# Altium schematic sheet CLK_src&sys_logic.SchDoc
size A2
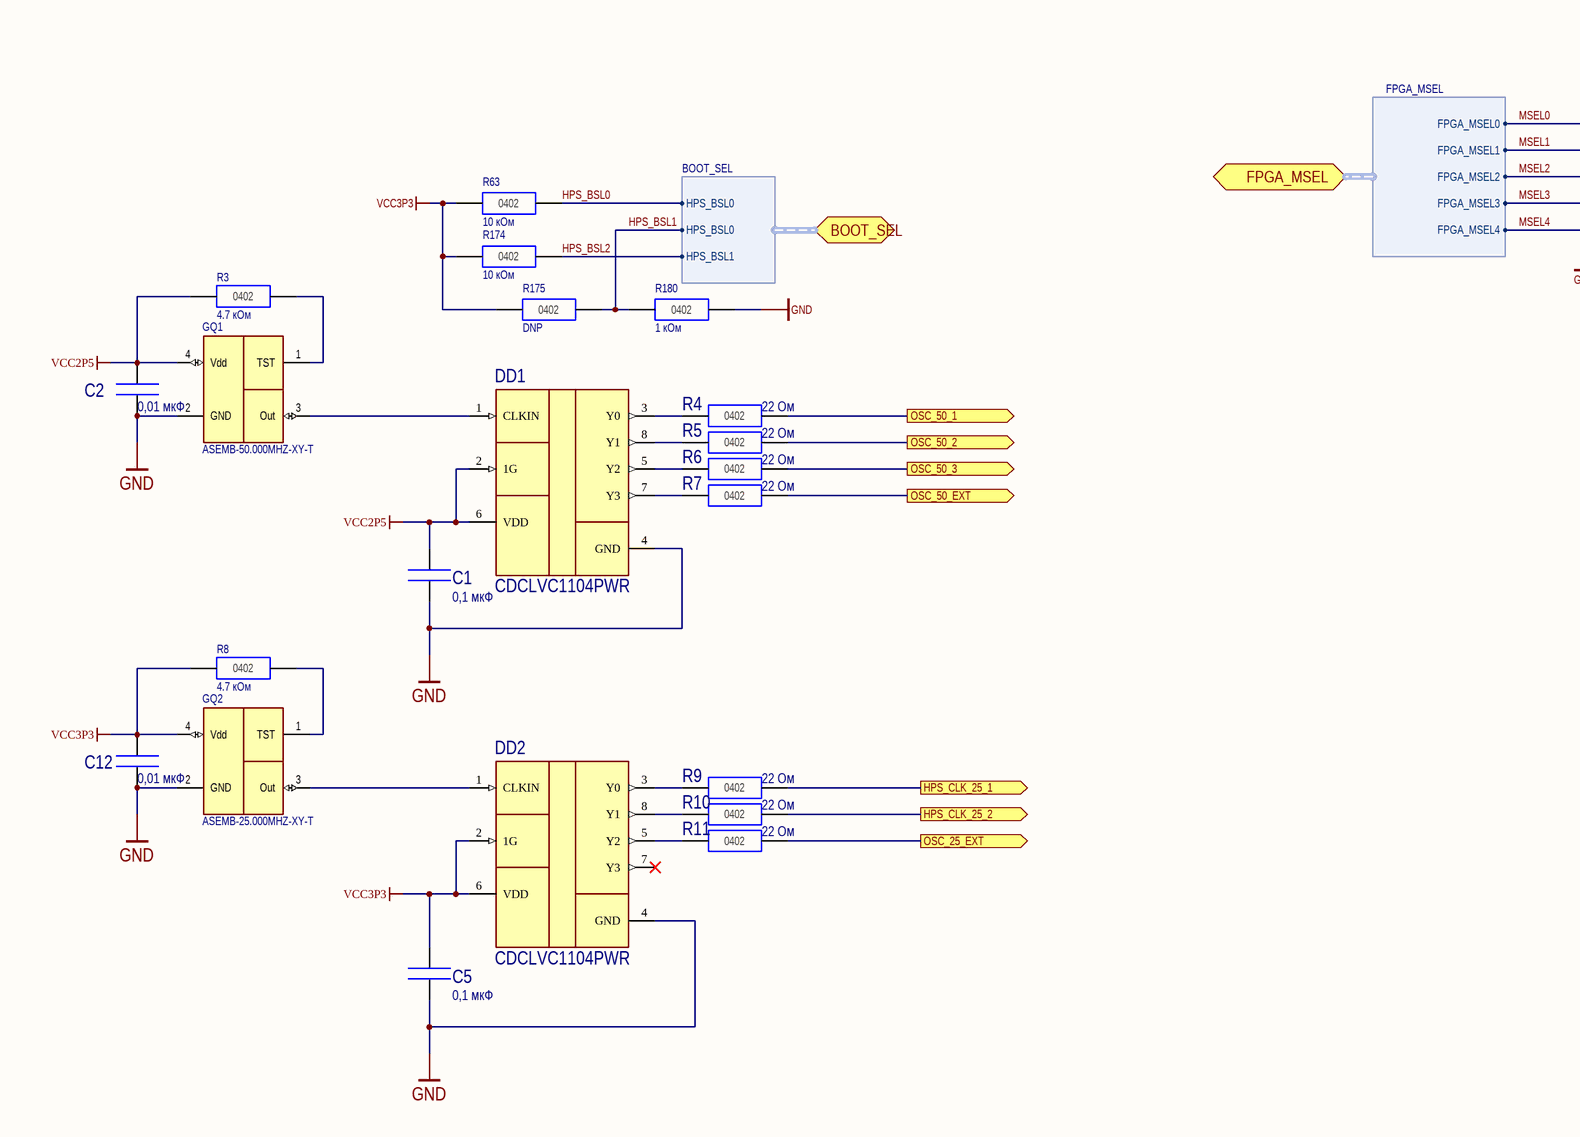
[diagram p0: CLK_src&sys_logic.SchDoc, left]
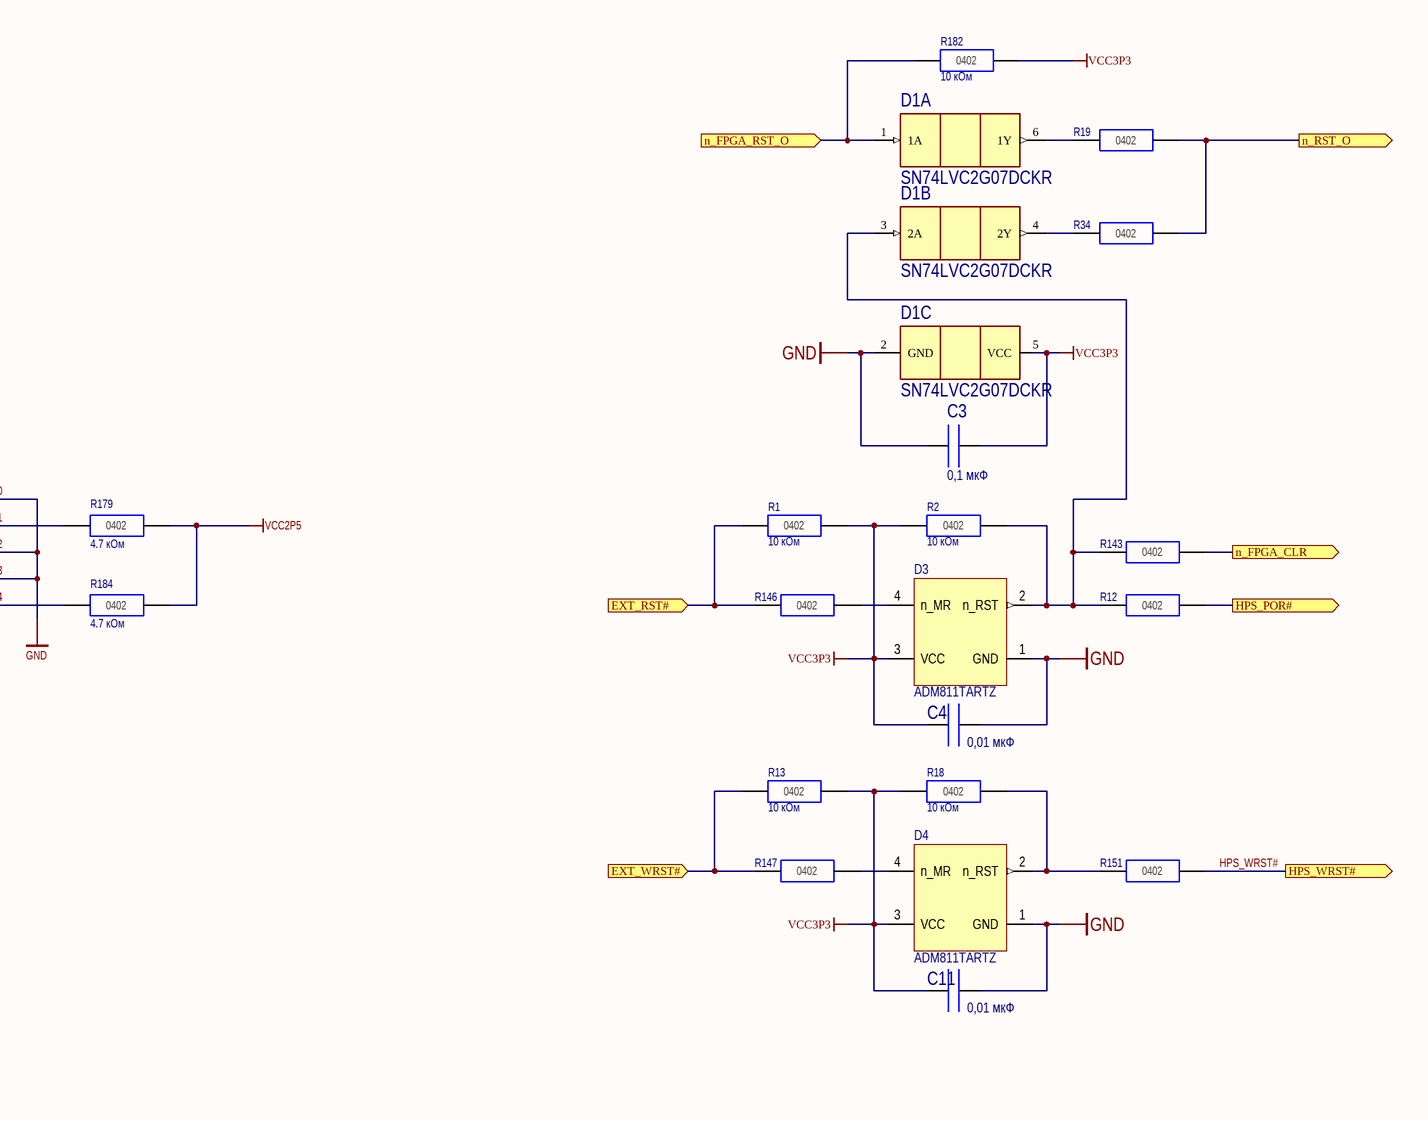
[diagram p1: CLK_src&sys_logic.SchDoc, right]

## Parts
C1  value 0,1 мкФ  [CC0402(1005)]  (hidden comment: CC0402-X7R-0,1 мкФ-20%-10В)
C2  value 0,01 мкФ  [CC0402(1005)]  (hidden comment: CC0402-X7R-0,01 мкФ-10%-50В)
C3  value 0,1 мкФ  [CC0402(1005)]  (hidden comment: CC0402-X7R-0,1 мкФ-20%-10В)
C4  value 0,01 мкФ  [CC0402(1005)]  (hidden comment: CC0402-X7R-0,01 мкФ-10%-50В)
C5  value 0,1 мкФ  [CC0402(1005)]  (hidden comment: CC0402-X7R-0,1 мкФ-20%-10В)
C11  value 0,01 мкФ  [CC0402(1005)]  (hidden comment: CC0402-X7R-0,01 мкФ-10%-50В)
C12  value 0,01 мкФ  [CC0402(1005)]  (hidden comment: CC0402-X7R-0,01 мкФ-10%-50В)
D1  SN74LVC2G07DCKR  [DCKR]  (parts A,B,C of 3)
D3  ADM811TARTZ  [SOT-143]
D4  ADM811TARTZ  [SOT-143]
DD1  CDCLVC1104PWR  [TSSOP-8]
DD2  CDCLVC1104PWR  [TSSOP-8]
GQ1  ASEMB-50.000MHZ-XY-T  [DFN210P320X100-4N]
GQ2  ASEMB-25.000MHZ-XY-T  [DFN210P320X100-4N]
R1  value 10 кОм  [CR0402(1005)]  (hidden comment: CR0402-10 кОм-±5%)
R2  value 10 кОм  [CR0402(1005)]  (hidden comment: CR0402-10 кОм-±5%)
R3  value 4.7 кОм  [CR0402(1005)]  (hidden comment: CR0402-4.7 кОм-±5%)
R4  value 22 Ом  [CR0402(1005)]  (hidden comment: CR0402-22 Ом-±5%)
R5  value 22 Ом  [CR0402(1005)]  (hidden comment: CR0402-22 Ом-±5%)
R6  value 22 Ом  [CR0402(1005)]  (hidden comment: CR0402-22 Ом-±5%)
R7  value 22 Ом  [CR0402(1005)]  (hidden comment: CR0402-22 Ом-±5%)
R8  value 4.7 кОм  [CR0402(1005)]  (hidden comment: CR0402-4.7 кОм-±5%)
R9  value 22 Ом  [CR0402(1005)]  (hidden comment: CR0402-22 Ом-±5%)
R10  value 22 Ом  [CR0402(1005)]  (hidden comment: CR0402-22 Ом-±5%)
R11  value 22 Ом  [CR0402(1005)]  (hidden comment: CR0402-22 Ом-±5%)
R12  CR0402-0 Ом-±5%  [CR0402(1005)]  (value not drawn)
R13  value 10 кОм  [CR0402(1005)]  (hidden comment: CR0402-10 кОм-±5%)
R18  value 10 кОм  [CR0402(1005)]  (hidden comment: CR0402-10 кОм-±5%)
R19  CR0402-0 Ом-±5%  [CR0402(1005)]  (value not drawn)
R34  CR0402-0 Ом-±5%  [CR0402(1005)]  (value not drawn)
R63  value 10 кОм  [CR0402(1005)]  (hidden comment: CR0402-10 кОм-±5%)
R143  CR0402-0 Ом-±5%  [CR0402(1005)]  (value not drawn)
R146  CR0402-0 Ом-±5%  [CR0402(1005)]  (value not drawn)
R147  CR0402-0 Ом-±5%  [CR0402(1005)]  (value not drawn)
R151  CR0402-0 Ом-±5%  [CR0402(1005)]  (value not drawn)
R174  value 10 кОм  [CR0402(1005)]  (hidden comment: CR0402-10 кОм-±5%)
R175  value DNP  [CR0402(1005)]  (hidden comment: CR0402-DNP-±5%)
R179  value 4.7 кОм  [CR0402(1005)]  (hidden comment: CR0402-4.7 кОм-±5%)
R180  value 1 кОм  [CR0402(1005)]  (hidden comment: CR0402-1 кОм-±5%)
R182  value 10 кОм  [CR0402(1005)]  (hidden comment: CR0402-10 кОм-±5%)
R184  value 4.7 кОм  [CR0402(1005)]  (hidden comment: CR0402-4.7 кОм-±5%)

## Ports
BOOT_SEL (harness BOOT_SEL), EXT_RST# (in), EXT_WRST# (in), FPGA_MSEL (harness FPGA_MSEL), HPS_CLK_25_1 (out), HPS_CLK_25_2 (out), HPS_POR# (out), HPS_WRST# (out), n_FPGA_CLR (out), n_FPGA_RST_O (in), n_RST_O (out), OSC_25_EXT (out), OSC_50_1 (out), OSC_50_2 (out), OSC_50_3 (out), OSC_50_EXT (out)

## Harnesses
FPGA_MSEL: FPGA_MSEL0, FPGA_MSEL1, FPGA_MSEL2, FPGA_MSEL3, FPGA_MSEL4
BOOT_SEL: HPS_BSL0, HPS_BSL0, HPS_BSL1

## Nets
MSEL0: C1.2(-) C2.1(+) C3.1(+) C4.1(+) C5.2(-) C11.1(+) C12.1(+) D1.2(GND) D3.1(GND) D4.1(GND) DD1.4(GND) DD2.4(GND) GQ1.2(GND) GQ2.2(GND) R180.2(-) ; port FPGA_MSEL.FPGA_MSEL0, port FPGA_MSEL.FPGA_MSEL2, port FPGA_MSEL.FPGA_MSEL3  [also labelled GND, MSEL2, MSEL3]
VCC2P5: C1.1(+) C2.2(-) DD1.2(1G) DD1.6(VDD) GQ1.4(Vdd) R3.1(+) R179.2(-) R184.2(-)
VCC3P3: C3.2(-) C4.2(-) C5.1(+) C11.2(-) C12.2(-) D1.5(VCC) D3.3(VCC) D4.3(VCC) DD2.2(1G) DD2.6(VDD) GQ2.4(Vdd) R1.2(-) R2.1(+) R8.1(+) R13.2(-) R18.1(+) R63.1(+) R174.1(+) R175.1(+) R182.2(-)
EXT_RST#: R1.1(+) R146.1(+) ; port EXT_RST#
EXT_WRST#: R13.1(+) R147.1(+) ; port EXT_WRST#
HPS_BSL0: R63.2(-) R175.2(-) R180.1(+) ; port BOOT_SEL.HPS_BSL0  [also labelled HPS_BSL1]
HPS_BSL2: R174.2(-) ; port BOOT_SEL.HPS_BSL1
HPS_CLK_25_1: R9.2(-) ; port HPS_CLK_25_1
HPS_CLK_25_2: R10.2(-) ; port HPS_CLK_25_2
HPS_POR#: R12.2(-) ; port HPS_POR#
HPS_WRST#: R151.2(-) ; port HPS_WRST#
MSEL1: R179.1(+) ; port FPGA_MSEL.FPGA_MSEL1
MSEL4: R184.1(+) ; port FPGA_MSEL.FPGA_MSEL4
n_FPGA_CLR: R143.2(-) ; port n_FPGA_CLR
n_FPGA_RST_O: D1.1(1A) R182.1(+) ; port n_FPGA_RST_O
n_RST_O: R19.2(-) R34.2(-) ; port n_RST_O
OSC_25_EXT: R11.2(-) ; port OSC_25_EXT
OSC_50_1: R4.2(-) ; port OSC_50_1
OSC_50_2: R5.2(-) ; port OSC_50_2
OSC_50_3: R6.2(-) ; port OSC_50_3
OSC_50_EXT: R7.2(-) ; port OSC_50_EXT
NetD1_3: D1.3(2A) D3.2(n_RST) R2.2(-) R12.1(+) R143.1(+)
NetD1_4: D1.4(2Y) R34.1(+)
NetD1_6: D1.6(1Y) R19.1(+)
NetD3_4: D3.4(n_MR) R146.2(-)
NetD4_2: D4.2(n_RST) R18.2(-) R151.1(+)
NetD4_4: D4.4(n_MR) R147.2(-)
NetDD1_1: DD1.1(CLKIN) GQ1.3(Out)
NetDD1_3: DD1.3(Y0) R4.1(+)
NetDD1_5: DD1.5(Y2) R6.1(+)
NetDD1_7: DD1.7(Y3) R7.1(+)
NetDD1_8: DD1.8(Y1) R5.1(+)
NetDD2_1: DD2.1(CLKIN) GQ2.3(Out)
NetDD2_3: DD2.3(Y0) R9.1(+)
NetDD2_5: DD2.5(Y2) R11.1(+)
NetDD2_8: DD2.8(Y1) R10.1(+)
NetGQ1_1: GQ1.1(TST) R3.2(-)
NetGQ2_1: GQ2.1(TST) R8.2(-)

Not connected (* = marked no-connect by the designer): DD2 7(Y3)*

## Notes on the sheet
- (in symbol CR0402-#-±5%) 0402

## Library data of the parts
C1-C5 C11 C12 = CC0402-X7R-#-20%-10В: Чип конденсатор керамический; Supplier 1: Digi-Key
  C1 C3 C5: Supplier Part Number 1: 399-3520-1-ND
  C2 C4 C11 C12: Supplier Part Number 1: 490-4516-2-ND
D1 = IC_TI_SN74LVC2G07: Dual Buffer and Driver With Open-Drain Outputs; Supplier 1: Digi-Key; Supplier Part Number 1: 296-13495-2-ND
D3 D4 = IC_AD_ADM811TARTZ: Microprocessor Supervisory Circuit in 3-Pin SOT-23; LatestRevisionNote: Re-released for DXP Platform.; DatasheetVersion: REV.H 2016; Publisher: Altium Limited; PackageDescription: SOT-143; 4 Leads; Body 3.0 x 2.6 mm, inc. leads (LxW max); ComponentLink1Description: Manufacturer Link; ComponentLink1URL: http://www.analog.com/en/products/power-management/supervisory/simple-reset-supervisory-ic/adm811.html?doc=adm811_812.pdf; ComponentLink2Description: Datasheet; ComponentLink2URL: http://www.analog.com/en/products/power-management/supervisory/simple-reset-supervisory-ic/adm811.html?doc=adm811_812.pdf#product-overview
DD1 DD2 = CDCLVC1104PWR: High-Performance  Clock Buffer 1:4; Supplier 1: Digi-Key; Supplier Part Number 1: 296-27549-1-ND
GQ1 GQ2 = OSC-ABRCN-ASE3: Dual High Side Switch With OC_DET 500mA/CH; Manufacturer Name: Abracon LLC
  GQ1: Manufacturer Part No.: ASEMB-50.000MHZ-XY-T
  GQ2: Manufacturer Part No.: ASEMB-25.000MHZ-XY-T
R1-R11 R13 R18 R63 R174 R175 R179 R180 R182 R184 = CR0402-#-±5%: Чип резистор; Maximum Working Voltage: 50 В; TOLERANCE: 5%; Supplier 1: Digi-Key
  R1 R2 R13 R18 R63 R174 R175 R182: Supplier Part Number 1: 311-10.0KJRTR-ND
  R3 R8 R179 R184: Supplier Part Number 1: 311-4.7KJRTR-ND
  R4-R7 R9-R11: Supplier Part Number 1: 311-10.0KLRDKR-ND
  R180: Supplier Part Number 1: 311-1.0KJRTR-ND
R12 R19 R34 R143 R146 R147 R151 = CR0402-#-±5%: Чип резистор; Maximum Working Voltage: 50 В; TOLERANCE: 5%; VALUE: 0 Ом; Supplier 1: Digi-Key; Supplier Part Number 1: 311-10.0KLRDKR-ND